# Altium schematic sheet Extension_CN.SchDoc: Extension Connectors
size A4; Date: Not used; ApprovedBy: Not used; CheckedBy: Not used; Author: Not used; CompanyName: STMicroelectronics; DrawnBy: Not used; Engineer: Not used; Organization: Not used; Address1: Not used; Address2: Not used; Address3: Not used; Address4: Not used; DocumentNumber: Not used; Revision: Not used; SheetNumber: 3; SheetTotal: 7; CurrentTime: Not used; CurrentDate: Not used; Time: Not used; DocumentFullPathAndName: Not used; DocumentName: Not used; ModifiedDate: Not used; ImagePath: Not used; ProjectName: Not used; Application_BuildNumber: Not used
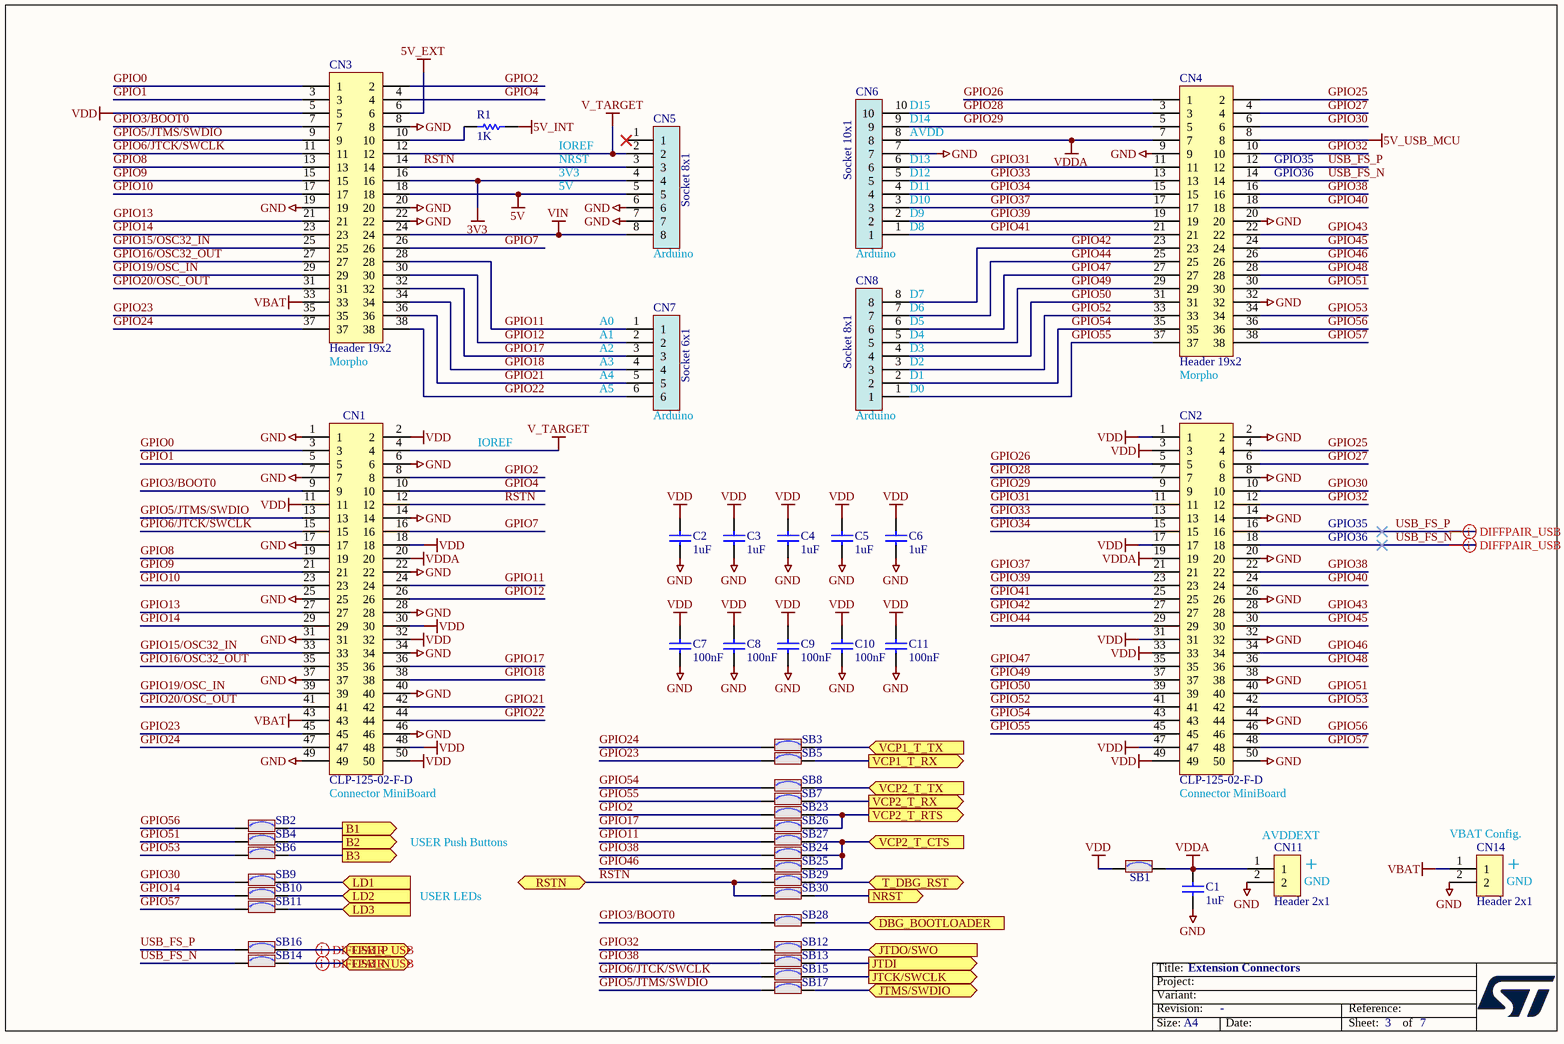
[diagram p0: Extension_CN.SchDoc]

## Parts
C1  value 1uF  [C0805_H0P85]  (hidden comment: Capacitor)
C2  value 1uF  [C0805_H0P85]  (hidden comment: Capacitor)
C3  value 1uF  [C0805_H0P85]  (hidden comment: Capacitor)
C4  value 1uF  [C0805_H0P85]  (hidden comment: Capacitor)
C5  value 1uF  [C0805_H0P85]  (hidden comment: Capacitor)
C6  value 1uF  [C0805_H0P85]  (hidden comment: Capacitor)
C7  value 100nF  [C0402]  (hidden comment: Capacitor)
C8  value 100nF  [C0402]  (hidden comment: Capacitor)
C9  value 100nF  [C0402]  (hidden comment: Capacitor)
C10  value 100nF  [C0402]  (hidden comment: Capacitor)
C11  value 100nF  [C0402]  (hidden comment: Capacitor)
CN1  CLP-125-02-F-D  [CON_SAMTEC_CLP-125-02-F-D]
CN2  CLP-125-02-F-D  [CON_SAMTEC_CLP-125-02-F-D]
CN3  Header 19x2  [CON_SAMTEC_TSW-119-09-X-D]
CN4  Header 19x2  [CON_SAMTEC_TSW-119-09-X-D]
CN5  Socket 8x1  [CON_SAMTEC_SSW-108-01-X-S]
CN6  Socket 10x1  [CON_SAMTEC_SSW-110-01-X-S]
CN7  Socket 6x1  [CON_SAMTEC_SSW-106-01-X-S]
CN8  Socket 8x1  [CON_SAMTEC_SSW-108-01-X-S]
CN11  Header 2x1  [CON_SAMTEC_TSW-102-07-G-S]
CN14  Header 2x1  [CON_SAMTEC_TSW-102-07-G-S]
R1  value 1K  [R0402]  (hidden comment: Resistor)
SB1  SB_ON  [SOLDER-BRIDGE_R0402-0R]  (value not drawn)
SB2  SB_ON  [SOLDER-BRIDGE_R0402-0R]  (value not drawn)
SB3  SB_ON  [SOLDER-BRIDGE_R0402-0R]  (value not drawn)
SB4  SB_ON  [SOLDER-BRIDGE_R0402-0R]  (value not drawn)
SB5  SB_ON  [SOLDER-BRIDGE_R0402-0R]  (value not drawn)
SB6  SB_ON  [SOLDER-BRIDGE_R0402-0R]  (value not drawn)
SB7  SB_ON  [SOLDER-BRIDGE_R0402-0R]  (value not drawn)
SB8  SB_ON  [SOLDER-BRIDGE_R0402-0R]  (value not drawn)
SB9  SB_ON  [SOLDER-BRIDGE_R0402-0R]  (value not drawn)
SB10  SB_ON  [SOLDER-BRIDGE_R0402-0R]  (value not drawn)
SB11  SB_ON  [SOLDER-BRIDGE_R0402-0R]  (value not drawn)
SB12  SB_ON  [SOLDER-BRIDGE_R0402-0R]  (value not drawn)
SB13  SB_ON  [SOLDER-BRIDGE_R0402-0R]  (value not drawn)
SB14  SB_ON  [SOLDER-BRIDGE_R0402-0R]  (value not drawn)
SB15  SB_ON  [SOLDER-BRIDGE_R0402-0R]  (value not drawn)
SB16  SB_ON  [SOLDER-BRIDGE_R0402-0R]  (value not drawn)
SB17  SB_ON  [SOLDER-BRIDGE_R0402-0R]  (value not drawn)
SB23  SB_ON  [SOLDER-BRIDGE_R0402-0R]  (value not drawn)
SB24  SB_ON  [SOLDER-BRIDGE_R0402-0R]  (value not drawn)
SB25  SB_ON  [SOLDER-BRIDGE_R0402-0R]  (value not drawn)
SB26  SB_ON  [SOLDER-BRIDGE_R0402-0R]  (value not drawn)
SB27  SB_ON  [SOLDER-BRIDGE_R0402-0R]  (value not drawn)
SB28  SB_ON  [SOLDER-BRIDGE_R0402-0R]  (value not drawn)
SB29  SB_ON  [SOLDER-BRIDGE_R0402-0R]  (value not drawn)
SB30  SB_ON  [SOLDER-BRIDGE_R0402-0R]  (value not drawn)

## Ports
B1 (out), B2 (out), B3 (out), DBG_BOOTLOADER (in), JTCK/SWCLK (out), JTDI (out), JTDO/SWO (in), JTMS/SWDIO (bidir), LD1 (in), LD2 (in), LD3 (in), NRST (out), RSTN (bidir), T_DBG_RST (bidir), USB_N (bidir), USB_P (bidir), VCP1_T_RX (out), VCP1_T_TX (in), VCP2_T_CTS (in), VCP2_T_RTS (out), VCP2_T_RX (out), VCP2_T_TX (in)

## Nets
3V3: CN3.16 CN5.4
5V: CN3.18 CN5.5
5V_EXT: CN3.6
5V_INT: R1.2
5V_USB_MCU: CN4.8
GND: C1.1 C2.1 C3.1 C4.1 C5.1 C6.1 C7.1 C8.1 C9.1 C10.1 C11.1 CN1.1 CN1.6 CN1.7 CN1.14 CN1.17 CN1.22 CN1.25 CN1.28 CN1.31 CN1.34 CN1.37 CN1.40 CN1.46 CN1.49 CN2.2 CN2.8 CN2.14 CN2.20 CN2.26 CN2.32 CN2.38 CN2.44 CN2.50 CN3.8 CN3.19 CN3.20 CN3.22 CN4.9 CN4.20 CN4.32 CN5.6 CN5.7 CN6.7 CN11.2 CN14.2
V_TARGET: CN1.4 CN3.12 CN5.2
VBAT: CN1.43 CN3.33 CN14.1
VDD: C2.2 C3.2 C4.2 C5.2 C6.2 C7.2 C8.2 C9.2 C10.2 C11.2 CN1.2 CN1.11 CN1.18 CN1.30 CN1.32 CN1.48 CN1.50 CN2.1 CN2.3 CN2.17 CN2.31 CN2.33 CN2.47 CN2.49 CN3.5 SB1.1
VDDA: C1.2 CN1.20 CN2.19 CN4.7 CN6.8 CN11.1 SB1.2
VIN: CN3.24 CN5.8
B1: SB2.2 ; port B1
B2: SB4.2 ; port B2
B3: SB6.2 ; port B3
DBG_BOOTLOADER: SB28.2 ; port DBG_BOOTLOADER
GPIO0: CN1.3 CN3.1
GPIO1: CN1.5 CN3.3
GPIO2: CN1.8 CN3.2 SB23.1
GPIO3/BOOT0: CN1.9 CN3.7 SB28.1
GPIO4: CN1.10 CN3.4
GPIO5/JTMS/SWDIO: CN1.13 CN3.9 SB17.1
GPIO6/JTCK/SWCLK: CN1.15 CN3.11 SB15.1
GPIO7: CN1.16 CN3.26
GPIO8: CN1.19 CN3.13
GPIO9: CN1.21 CN3.15
GPIO10: CN1.23 CN3.17
GPIO11: CN1.24 CN3.28 CN7.1 SB27.1
GPIO12: CN1.26 CN3.30 CN7.2
GPIO13: CN1.27 CN3.21
GPIO14: CN1.29 CN3.23 SB10.1
GPIO15/OSC32_IN: CN1.33 CN3.25
GPIO16/OSC32_OUT: CN1.35 CN3.27
GPIO17: CN1.36 CN3.32 CN7.3 SB26.1
GPIO18: CN1.38 CN3.34 CN7.4
GPIO19/OSC_IN: CN1.39 CN3.29
GPIO20/OSC_OUT: CN1.41 CN3.31
GPIO21: CN1.42 CN3.36 CN7.5
GPIO22: CN1.44 CN3.38 CN7.6
GPIO23: CN1.45 CN3.35 SB5.1
GPIO24: CN1.47 CN3.37 SB3.1
GPIO25: CN2.4 CN4.2
GPIO26: CN2.5 CN4.1
GPIO27: CN2.6 CN4.4
GPIO28: CN2.7 CN4.3 CN6.10
GPIO29: CN2.9 CN4.5 CN6.9
GPIO30: CN2.10 CN4.6 SB9.1
GPIO31: CN2.11 CN4.11 CN6.6
GPIO32: CN2.12 CN4.10 SB12.1
GPIO33: CN2.13 CN4.13 CN6.5
GPIO34: CN2.15 CN4.15 CN6.4
GPIO37: CN2.21 CN4.17 CN6.3
GPIO38: CN2.22 CN4.16 SB13.1 SB24.1
GPIO39: CN2.23 CN4.19 CN6.2
GPIO40: CN2.24 CN4.18
GPIO41: CN2.25 CN4.21 CN6.1
GPIO42: CN2.27 CN4.23 CN8.8
GPIO43: CN2.28 CN4.22
GPIO44: CN2.29 CN4.25 CN8.7
GPIO45: CN2.30 CN4.24
GPIO46: CN2.34 CN4.26 SB25.1
GPIO47: CN2.35 CN4.27 CN8.6
GPIO48: CN2.36 CN4.28
GPIO49: CN2.37 CN4.29 CN8.5
GPIO50: CN2.39 CN4.31 CN8.4
GPIO51: CN2.40 CN4.30 SB4.1
GPIO52: CN2.41 CN4.33 CN8.3
GPIO53: CN2.42 CN4.34 SB6.1
GPIO54: CN2.43 CN4.35 CN8.2 SB8.1
GPIO55: CN2.45 CN4.37 CN8.1 SB7.1
GPIO56: CN2.46 CN4.36 SB2.1
GPIO57: CN2.48 CN4.38 SB11.1
JTCK/SWCLK: SB15.2 ; port JTCK/SWCLK
JTDI: SB13.2 ; port JTDI
JTDO/SWO: SB12.2 ; port JTDO/SWO
JTMS/SWDIO: SB17.2 ; port JTMS/SWDIO
LD1: SB9.2 ; port LD1
LD2: SB10.2 ; port LD2
LD3: SB11.2 ; port LD3
NRST: SB30.2 ; port NRST
RSTN: CN1.12 CN3.14 CN5.3 SB29.1 SB30.1 ; port RSTN
T_DBG_RST: SB29.2 ; port T_DBG_RST
USB_FS_N: CN2.18 CN4.14 SB14.1
USB_FS_P: CN2.16 CN4.12 SB16.1
USB_N: SB14.2 ; port USB_N
USB_P: SB16.2 ; port USB_P
VCP1_T_RX: SB5.2 ; port VCP1_T_RX
VCP1_T_TX: SB3.2 ; port VCP1_T_TX
VCP2_T_CTS: SB24.2 SB25.2 SB27.2 ; port VCP2_T_CTS
VCP2_T_RTS: SB23.2 SB26.2 ; port VCP2_T_RTS
VCP2_T_RX: SB7.2 ; port VCP2_T_RX
VCP2_T_TX: SB8.2 ; port VCP2_T_TX
NetCN3_10: CN3.10 R1.1

Not connected (* = marked no-connect by the designer): CN5 1*

## Layout directives
differential pair; rule Impedance Constraint [Min = 85.00    Max = 95.00    ]: USB_FS_N, USB_FS_P, USB_N, USB_P

## Notes on the sheet
- (near CN6) D15
- IOREF
- NRST
- 3V3
- (near CN6) D12
- (near CN6) D13
- (near CN6) D14
- (near CN6) AVDD
- (near CN4) GPIO35
- (near CN4) GPIO36
- 5V
- (near CN6) D8
- (near CN6) D9
- (near CN6) D10
- (near CN6) D11
- (near CN5) Arduino
- (near CN6) Arduino
- (near CN8) D6
- (near CN8) D7
- (near CN3) Morpho
- (near CN7) A0
- (near CN7) A1
- (near CN7) A2
- (near CN7) A3
- (near CN7) A4
- (near CN8) D1
- (near CN8) D2
- (near CN8) D3
- (near CN8) D4
- (near CN8) D5
- (near CN4) Morpho
- (near CN7) A5
- (near CN7) Arduino
- (near CN8) Arduino
- (near CN8) D0
- GPIO35
- GPIO36
- (near CN1) Connector MiniBoard
- USER Push Buttons
- (near CN2) Connector MiniBoard
- (near CN11) AVDDEXT
- (near CN14) VBAT Config.
- USER LEDs
- (near CN11) GND
- (near CN11) +
- (near CN14) GND
- (near CN14) +
- Title:
- Project:
- Size:
- Revision:
- Variant:
- -
- Date:
- Reference:
- Sheet:
- of

## Library data of the parts
C1-C6 = MCD-01550: Capacitor, MLCC, 1uF, 16V, X5R, +/-10%, 0805, T=0.85mm; Manufacturer_Part_Number: CC0805KRX5R7BB105; Manufacturer: YAGEO; Part_Preference: Recommended; Component_Country_Of_Origin: China; Internal_Part_Number: MCD-01550; Status: Released; Part_Type: Capacitor; Package: 0805; ComponentLink1URL: http://tunmcdsvn.tun.st.com/Component_Documentation_Library/Trunk/Capacitor/YAGEO_X5R_Series; Order_Code_Digikey: 311-3427-1-ND; Order_Code_Farnell: N/A; Order_Code_RS: N/A
C7-C11 = MCD-02355: Capacitor, MLCC, 100nF, 25V, X7R, +/-10%, 0402, T=0.5mm; Part_Preference: Recommended; Manufacturer: WALSIN; Manufacturer_Part_Number: 0402B104K250CT; Order_Code_RS: 176-3114; Component_Country_Of_Origin: Unknown; Internal_Part_Number: MCD-02355; Status: Checked; Part_Type: Capacitor; Package: 0402; ComponentLink1URL: http://tunmcdsvn.tun.st.com/Component_Documentation_Library/Trunk/Capacitor/WALSIN_Monolithic_Series/; Order_Code_Digikey: 1292-1175-1-ND; Order_Code_Farnell: 2496772
CN1 CN2 = MCD-02705: Socket, 25x2, 1.27mm, VR, SMD, T=2.29mm; Part_Type: Connector; Part_Preference: Recommended; Manufacturer: SAMTEC; Value: Socket 25x2; Order_Code_RS: 180-3642; Component_Country_Of_Origin: USA; ShowFields: YES; ID: 4811; Order_Code_Digikey: SAM1153-25-ND; Order_Code_Farnell: 2779411; Status: Checked; ComponentLink1URL: http://tunmcdsvn.tun.st.com/Component_Documentation_Library/Trunk/Connector/SAMTEC_CLP_Series; Internal_Part_Number: MCD-02705; Manufacturer_Part_Number: CLP-125-02-F-D
CN3 CN4 = MCD-00213: Header, 19x2, 2.54mm, VR, TH, T=5.84mm/10.16mm; Part_Type: Connector; Part_Preference: Recommended; Manufacturer: SAMTEC; Manufacturer_Part_Number: TSW-119-09-G-D; Component_Country_Of_Origin: China, Costa Rica, Malaysia, United States, Vietnam; Internal_Part_Number: MCD-00213; Value: Header 19x2; Status: Released; ComponentLink1URL: http://tunmcdsvn.tun.st.com/Component_Documentation_Library/Trunk/Connector/SAMTEC_TSW_Series/; Order_Code_Digikey: TSW-119-09-G-D-ND; Order_Code_Farnell: 3664236; Order_Code_RS: N/A
CN5 CN8 = MCD-01743: Socket, 8x1, 2.54mm, VR, TH, T=8.51/2.64mm; Part_Type: Connector; Part_Preference: Recommended; Manufacturer: SAMTEC; Manufacturer_Part_Number: SSW-108-01-G-S; Order_Code_RS: 765-5698; Component_Country_Of_Origin: China, Costa Rica, Malaysia, United States, Vietnam; Internal_Part_Number: MCD-01743; Value: Socket 8x1; Status: Released; ComponentLink1URL: http://tunmcdsvn.tun.st.com/Component_Documentation_Library/Trunk/Connector/SAMTEC_SSW-SSQ(TH)_Series/; Order_Code_Digikey: SAM1209-08-ND; Order_Code_Farnell: 1668363
CN6 = MCD-02080: Socket, 10x1, 2.54mm, VR, TH, T=8.51/2.64mm; Part_Type: Connector; Part_Preference: Recommended; Manufacturer: SAMTEC; Manufacturer_Part_Number: SSW-110-01-G-S; Order_Code_RS: 765-5736; Component_Country_Of_Origin: China, Costa Rica, Malaysia, United States, Vietnam; Internal_Part_Number: MCD-02080; Value: Socket 10x1; Status: Checked; ComponentLink1URL: http://tunmcdsvn.tun.st.com/Component_Documentation_Library/Trunk/Connector/SAMTEC_SSW-SSQ(TH)_Series/; Order_Code_Digikey: SSW-110-01-G-S-LL-ND; Order_Code_Farnell: 1668374
CN7 = MCD-02079: Socket, 6x1, 2.54mm, VR, TH, T=8.51/2.64mm; Part_Type: Connector; Part_Preference: Recommended; Manufacturer: SAMTEC; Manufacturer_Part_Number: SSW-106-01-G-S; Order_Code_RS: 765-5666; Component_Country_Of_Origin: China, Costa Rica, Malaysia, United States, Vietnam; Internal_Part_Number: MCD-02079; Value: Socket 6x1; Status: Checked; ComponentLink1URL: http://tunmcdsvn.tun.st.com/Component_Documentation_Library/Trunk/Connector/SAMTEC_SSW-SSQ(TH)_Series/; Order_Code_Digikey: SSW-106-01-G-S-LL-ND; Order_Code_Farnell: 1668352
CN11 CN14 = MCD-00032: Header, 2x1, 2.54mm, VR, TH, T=5.84mm/2.54mm; Part_Type: Connector; Part_Preference: Recommended; Manufacturer: SAMTEC; Manufacturer_Part_Number: TSW-102-07-G-S; Order_Code_RS: 155-5312; Component_Country_Of_Origin: China, Costa Rica, Malaysia, United States, Vietnam; Internal_Part_Number: MCD-00032; Value: Header 2x1; Status: Released; ComponentLink1URL: http://tunmcdsvn.tun.st.com/Component_Documentation_Library/Trunk/Connector/SAMTEC_TSW_Series/; Order_Code_Digikey: SAM1029-02-ND; Order_Code_Farnell: 2505044
R1 = MCD-00061: Resistor, 1K, 0402, +/-1%,1/16W; Part_Preference: Recommended; Manufacturer: YAGEO; Manufacturer_Part_Number: RC0402FR-071KL; Component_Country_Of_Origin: China; Internal_Part_Number: MCD-00061; Status: Released; Part_Type: Resistor; Package: 0402; ComponentLink1URL: http://tunmcdsvn.tun.st.com/Component_Documentation_Library/Trunk/Resistor/YAGEO_RC_L_Series; Order_Code_Digikey: 311-1.00KLRCT-ND; Order_Code_Farnell: 9239235; Order_Code_RS: N/A
SB1-SB17 SB23-SB30 = MCD-01618: Solder Bridge 0402 ON; Part_Type: Misc; Part_Preference: Recommended; Manufacturer: YAGEO; Manufacturer_Part_Number: RC0402JR-070RL; Order_Code_RS: 618-5804; Component_Country_Of_Origin: China; Internal_Part_Number: MCD-01618; Status: Released; Package: SB0402; ComponentLink1URL: http://tunmcdsvn.tun.st.com/Component_Datasheet_Library/Trunk/Resistors/Yageo_Resistor_RC0402-series; Order_Code_Digikey: 311-0.0JRTR-ND; Order_Code_Farnell: 2363467